# EAGLE design R201B (EAGLE 6.6.0)
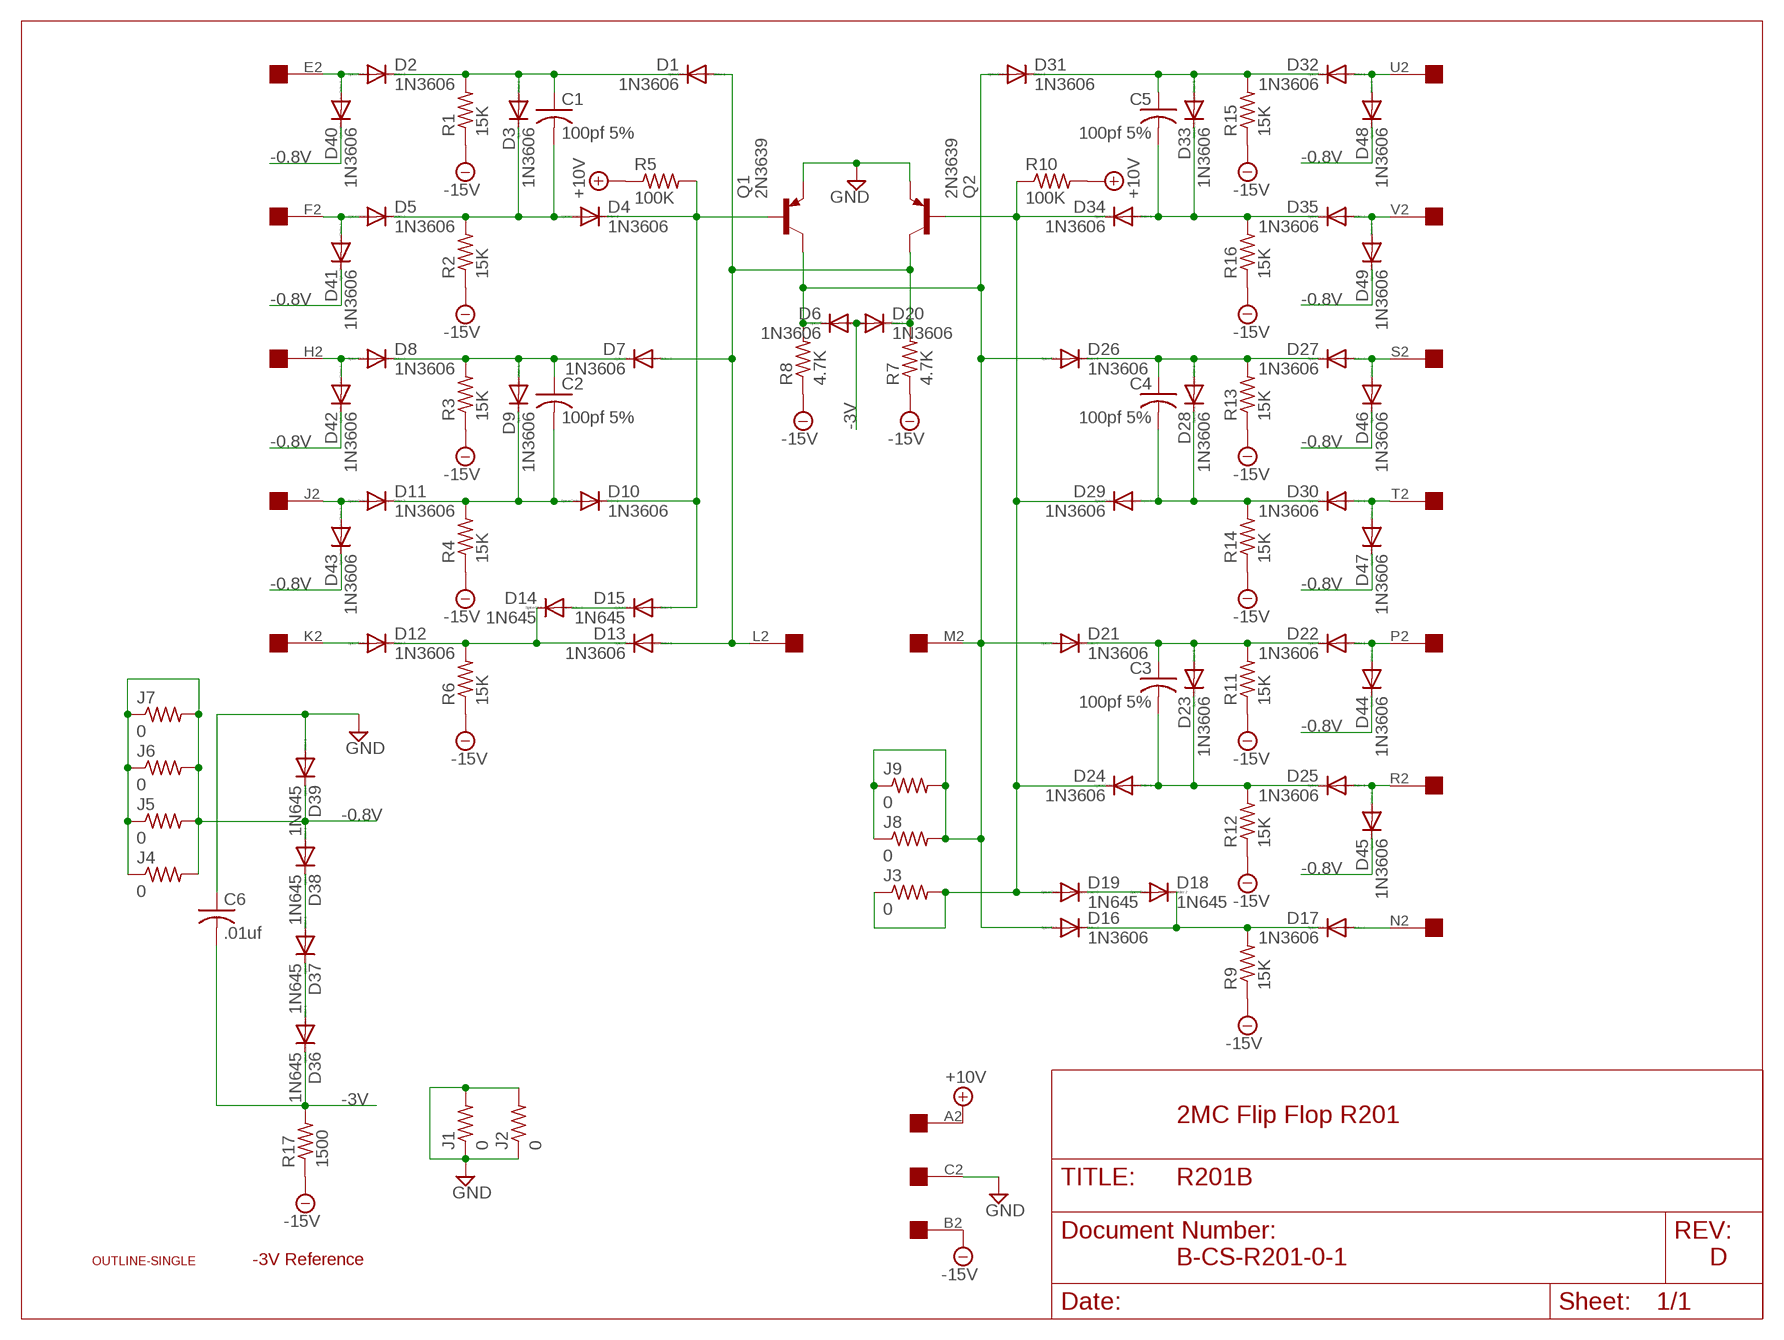
[diagram p0: schematic, sheet 1]

## Parts
C1  100pf 5%  C-US  [C063-025X075]
C2  100pf 5%  C-US  [C063-025X075]
C3  100pf 5%  C-US  [C063-025X075]
C4  100pf 5%  C-US  [C063-025X075]
C5  100pf 5%  C-US  [C063-025X075]
C6  .01uf  C-US  [C063-025X075]
D1  1N3606  1N4148DO35-10  [DO35-10]
D2  1N3606  1N4148DO35-10  [DO35-10]
D3  1N3606  1N4148DO35-10  [DO35-10]
D4  1N3606  1N4148DO35-10  [DO35-10]
D5  1N3606  1N4148DO35-10  [DO35-10]
D6  1N3606  1N4148DO35-10  [DO35-10]
D7  1N3606  1N4148DO35-10  [DO35-10]
D8  1N3606  1N4148DO35-10  [DO35-10]
D9  1N3606  1N4148DO35-10  [DO35-10]
D10  1N3606  1N4148DO35-10  [DO35-10]
D11  1N3606  1N4148DO35-10  [DO35-10]
D12  1N3606  1N4148DO35-10  [DO35-10]
D13  1N3606  1N4148DO35-10  [DO35-10]
D14  1N645  1N4148DO35-10  [DO35-10]
D15  1N645  1N4148DO35-10  [DO35-10]
D16  1N3606  1N4148DO35-10  [DO35-10]
D17  1N3606  1N4148DO35-10  [DO35-10]
D18  1N645  1N4148DO35-10  [DO35-10]
D19  1N645  1N4148DO35-10  [DO35-10]
D20  1N3606  1N4148DO35-10  [DO35-10]
D21  1N3606  1N4148DO35-10  [DO35-10]
D22  1N3606  1N4148DO35-10  [DO35-10]
D23  1N3606  1N4148DO35-10  [DO35-10]
D24  1N3606  1N4148DO35-10  [DO35-10]
D25  1N3606  1N4148DO35-10  [DO35-10]
D26  1N3606  1N4148DO35-10  [DO35-10]
D27  1N3606  1N4148DO35-10  [DO35-10]
D28  1N3606  1N4148DO35-10  [DO35-10]
D29  1N3606  1N4148DO35-10  [DO35-10]
D30  1N3606  1N4148DO35-10  [DO35-10]
D31  1N3606  1N4148DO35-10  [DO35-10]
D32  1N3606  1N4148DO35-10  [DO35-10]
D33  1N3606  1N4148DO35-10  [DO35-10]
D34  1N3606  1N4148DO35-10  [DO35-10]
D35  1N3606  1N4148DO35-10  [DO35-10]
D36  1N645  1N4148DO35-10  [DO35-10]
D37  1N645  1N4148DO35-10  [DO35-10]
D38  1N645  1N4148DO35-10  [DO35-10]
D39  1N645  1N4148DO35-10  [DO35-10]
D40  1N3606  1N4148DO35-10  [DO35-10]
D41  1N3606  1N4148DO35-10  [DO35-10]
D42  1N3606  1N4148DO35-10  [DO35-10]
D43  1N3606  1N4148DO35-10  [DO35-10]
D44  1N3606  1N4148DO35-10  [DO35-10]
D45  1N3606  1N4148DO35-10  [DO35-10]
D46  1N3606  1N4148DO35-10  [DO35-10]
D47  1N3606  1N4148DO35-10  [DO35-10]
D48  1N3606  1N4148DO35-10  [DO35-10]
D49  1N3606  1N4148DO35-10  [DO35-10]
J1  0  R-US_0207/10  [0207/10]
J2  0  R-US_0207/10  [0207/10]
J3  0  R-US_0207/10  [0207/10]
J4  0  R-US_0207/10  [0207/10]
J5  0  R-US_0207/10  [0207/10]
J6  0  R-US_0207/10  [0207/10]
J7  0  R-US_0207/10  [0207/10]
J8  0  R-US_0207/10  [0207/10]
J9  0  R-US_0207/10  [0207/10]
Q1  2N3639  2N3637  [TO39]
Q2  2N3639  2N3637  [TO39]
R1  15K  R-US_0207/10  [0207/10]
R2  15K  R-US_0207/10  [0207/10]
R3  15K  R-US_0207/10  [0207/10]
R4  15K  R-US_0207/10  [0207/10]
R5  100K  R-US_0207/10  [0207/10]
R6  15K  R-US_0207/10  [0207/10]
R7  4.7K  R-US_0207/10  [0207/10]
R8  4.7K  R-US_0207/10  [0207/10]
R9  15K  R-US_0207/10  [0207/10]
R10  100K  R-US_0207/10  [0207/10]
R11  15K  R-US_0207/10  [0207/10]
R12  15K  R-US_0207/10  [0207/10]
R13  15K  R-US_0207/10  [0207/10]
R14  15K  R-US_0207/10  [0207/10]
R15  15K  R-US_0207/10  [0207/10]
R16  15K  R-US_0207/10  [0207/10]
R17  1500  R-US_0207/10  [0207/10]
U$1  OUTLINE-SINGLE  [SINGLE]
U$2  EDGE-1  [EDGE-CON1]

## Nets
+10V [Power]: R5.1 R10.2 U$2.A2
-0.8V [Power]: D38.A D39.C D40.C D41.C D42.C D43.C D44.C D45.C D46.C D47.C D48.C D49.C J4.1 J4.2 J5.1 J5.2 J6.1 J6.2 J7.1 J7.2
-3V [Power]: C6.2 D6.A D20.A D36.C R17.2
-15V [Power]: R1.1 R2.1 R3.1 R4.1 R6.1 R7.1 R8.1 R9.1 R11.1 R12.1 R13.1 R14.1 R15.1 R16.1 R17.1 U$2.B2
GND [Power]: C6.1 D39.A J1.1 J1.2 J2.1 J2.2 Q1.1(E) Q2.1(E) U$2.C2
L: D1.A D7.A D13.A D20.C Q2.3(C) R7.2 U$2.L2
M: D6.C D16.A D21.A D26.A D31.A J8.1 J8.2 J9.1 J9.2 Q1.3(C) R8.2 U$2.M2
N$1: D5.A D41.A U$2.F2
N$2: C5.1 D31.C D32.C D33.A R15.2
N$3: C1.2 D3.C D4.A D5.C R2.2
N$4: C1.1 D1.C D2.C D3.A R1.2
N$5: D12.A U$2.K2
N$6: D19.A D24.C D29.C D34.C J3.1 J3.2 Q2.2(B) R10.1
N$7: D32.A D48.A U$2.U2
N$8: C5.2 D33.C D34.A D35.C R16.2
N$9: D17.A U$2.N2
N$10: D2.A D40.A U$2.E2
N$11: D35.A D49.A U$2.V2
N$12: D18.A D19.C
N$13: D37.A D38.C
N$14: D4.C D10.C D15.A Q1.2(B) R5.2
N$15: D14.A D15.C
N$16: D36.A D37.C
N$17: D22.A D44.A U$2.P2
N$18: D12.C D13.C D14.C R6.2
N$19: D8.A D42.A U$2.H2
N$20: D16.C D17.C D18.C R9.2
N$21: D11.A D43.A U$2.J2
N$22: C2.2 D9.C D10.A D11.C R4.2
N$23: D27.A D46.A U$2.S2
N$24: C2.1 D7.C D8.C D9.A R3.2
N$25: D30.A D47.A U$2.T2
N$26: C4.2 D28.C D29.A D30.C R14.2
N$27: C4.1 D26.C D27.C D28.A R13.2
N$28: D25.A D45.A U$2.R2
N$29: C3.2 D23.C D24.A D25.C R12.2
N$30: C3.1 D21.C D22.C D23.A R11.2
Unconnected: U$2.D2

## Notes on the sheet
- 2MC Flip Flop R201
- -3V Reference | B-CS-R201-0-1 | D

## Library data of the parts
C1-C6 = dec-con:C-US: Capacitors with funky DEC lead spacing.
D1-D49 = diode:1N4148: DIODE high speed (Philips)
J1-J9 R1-R17 = rcl:R-US_: RESISTOR, American symbol
Q1 Q2 = transistor-pnp:2N3637*: PNP Transistror
U$1 = dec-con:OUTLINE-*: Board outlines for DEC boards.
U$2 = dec-con:EDGE-1: Single-Sided DEC Edge Connector -- (side 2)

## Net classes
1 Power: width 0.813 mm

## Board
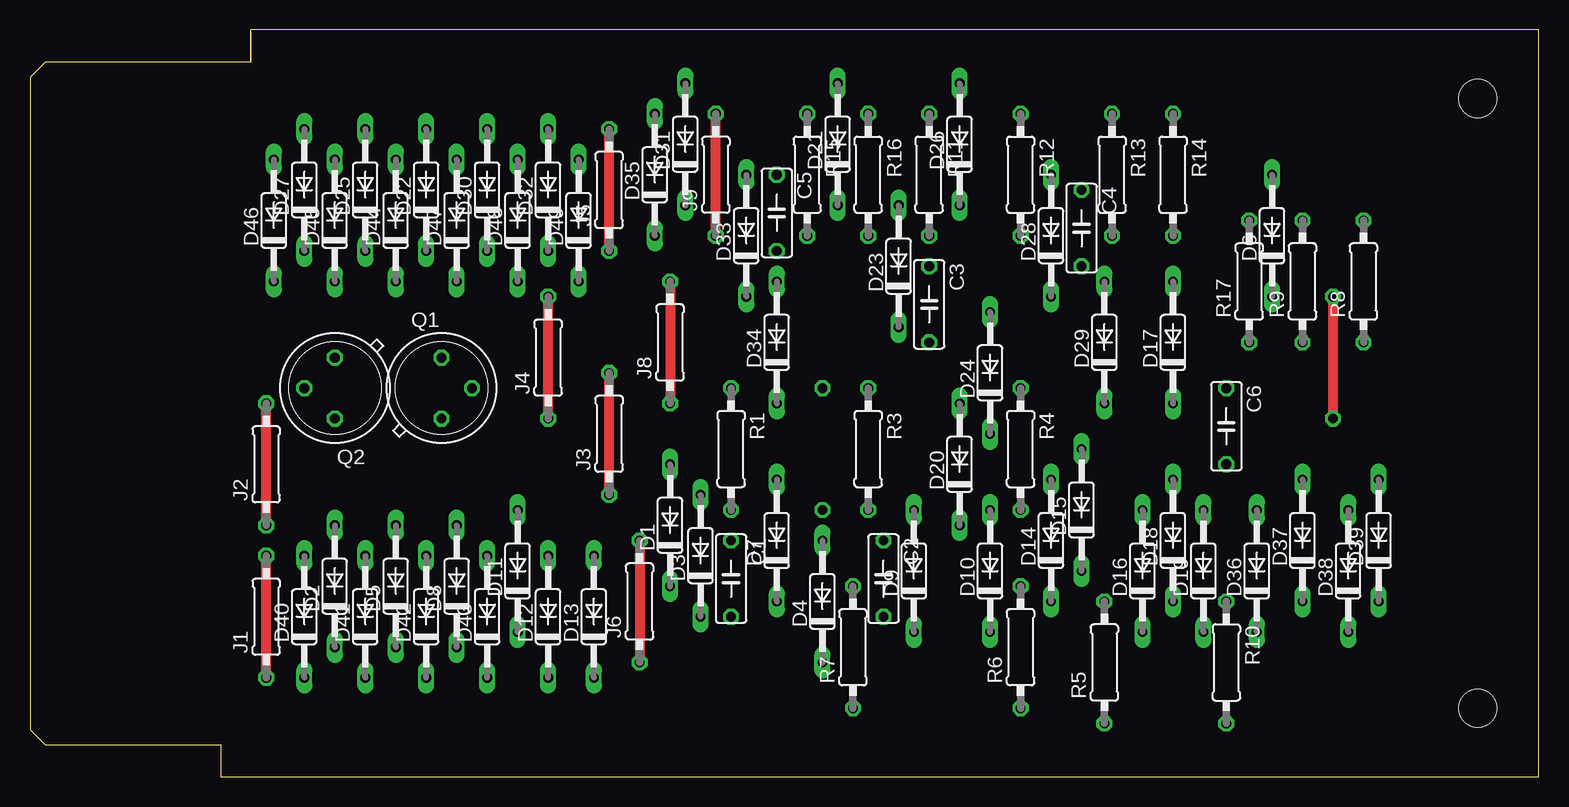
[diagram p1: board, top side]
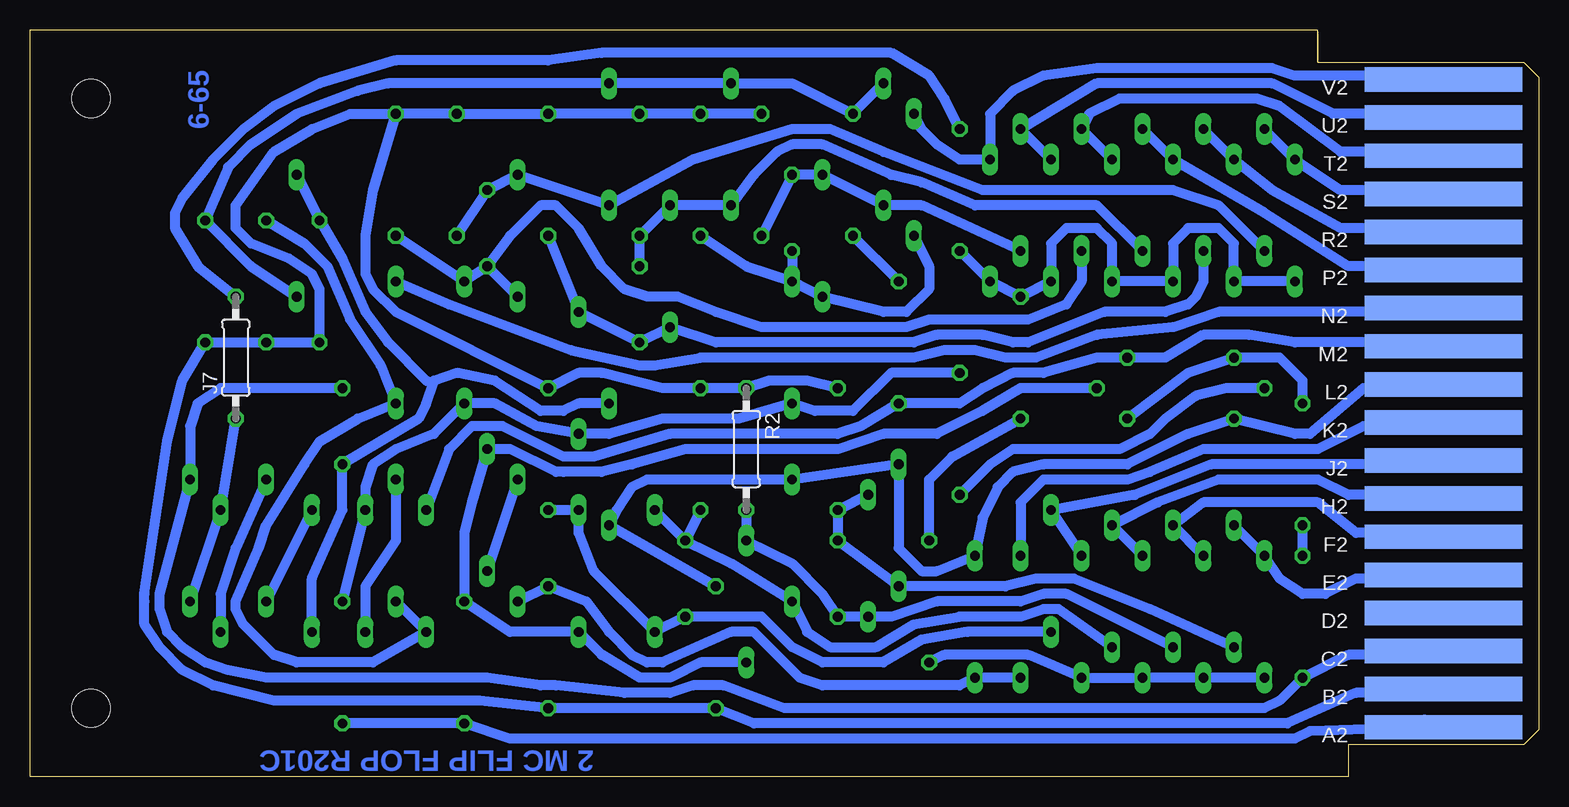
[diagram p2: board, bottom side, seen from below]

Size 125.73 x 62.23 mm. Coordinates in mm from the lower left corner, seen from the top.
Copper layers (1+16): Top 0.035mm / dielectric 1.5mm / Bottom 0.035mm
Design rules "16mils": minimum track width 16mil, minimum drill 32mil, track to track 15mil, track to pad 10mil, pad to pad 10mil, via to via 10mil, smd to smd 10mil, copper to edge 13mil, drill to drill 10mil, minimum pad ring 10mil, minimum via ring 8mil, stop-mask expansion 0mil, vias tented up to drill 0mil, thermal gap 10mil

### Footprints (pad centres in the part's own frame; a part is rotated, then mirrored left to right if it is on the bottom)
C063-025X075 = drill 0.813 octagon: 1 -2.54,0; 2 3.81,0
DO35-10 = drill 0.813 long: A 5.08,0; C -5.08,0
0207/10 = drill 0.813 octagon: 1 -5.08,0; 2 5.08,0
TO39 = drill 0.813 octagon: 1 0,-2.54; 2 2.54,0; 3 0,2.54
SINGLE = hole 3.175: 120.65,56.515; 120.65,5.715
EDGE-CON1 = smd 13.106 x 2.032 bottom: A2 7.938,4.128; B2 7.938,7.303; C2 7.938,10.477; D2 7.938,13.652; E2 7.938,16.828; F2 7.938,20.003; H2 7.938,23.177; J2 7.938,26.352; K2 7.938,29.527; L2 7.938,32.703; M2 7.938,35.877; N2 7.938,39.053; P2 7.938,42.227; R2 7.938,45.403; S2 7.938,48.578; T2 7.938,51.752; U2 7.938,54.928; V2 7.938,58.102

### Placement (x,y rotation side)
C1  58.42,17.14 270 top
C2  71.12,17.14 270 top
C3  74.93,40.01 270 top
C4  87.63,46.35 270 top
C5  62.23,47.62 270 top
C6  99.7,29.84 270 top
D1  53.34,20.95 90 top
D2  25.4,15.88 90 top
D3  55.88,18.41 90 top
D4  66.04,14.61 90 top
D5  30.48,15.88 90 top
D6  103.51,45.09 90 top
D7  62.23,19.68 90 top
D8  35.56,15.88 90 top
D9  73.66,17.14 90 top
D10  80.01,17.14 90 top
D11  40.64,17.14 90 top
D12  43.18,13.34 90 top
D13  46.99,13.34 90 top
D14  85.09,19.68 90 top
D15  87.63,22.23 90 top
D16  92.71,17.14 90 top
D17  95.25,36.2 90 top
D18  95.25,19.68 90 top
D19  97.79,17.14 90 top
D20  77.47,26.04 90 top
D21  67.31,52.7 90 top
D22  33.02,48.9 90 top
D23  72.39,42.55 90 top
D24  80.01,33.66 90 top
D25  27.94,48.9 90 top
D26  77.47,52.7 90 top
D27  22.86,48.9 90 top
D28  85.09,45.09 90 top
D29  89.54,36.2 90 top
D30  38.1,48.9 90 top
D31  54.61,52.7 90 top
D32  43.18,48.9 90 top
D33  59.69,45.09 90 top
D34  62.23,36.2 90 top
D35  52.07,50.16 90 top
D36  102.24,17.14 90 top
D37  106.05,19.68 90 top
D38  109.86,17.14 90 top
D39  112.4,19.68 90 top
D40  22.86,13.34 90 top
D41  27.94,13.34 90 top
D42  33.02,13.34 90 top
D43  38.1,13.34 90 top
D44  30.48,46.35 90 top
D45  25.4,46.35 90 top
D46  20.32,46.35 90 top
D47  35.56,46.35 90 top
D48  40.64,46.35 90 top
D49  45.72,46.35 90 top
J1  19.69,13.34 90 top
J2  19.69,26.04 90 top
J3  48.26,28.57 90 top
J4  43.18,34.92 90 top
J5  48.26,48.9 90 top
J6  50.8,14.61 90 top
J7  108.59,34.92 90 bottom
J8  53.34,36.2 90 top
J9  57.15,50.16 90 top
Q1  34.29,32.38 0 top
Q2  25.4,32.38 180 top
R1  58.42,27.3 270 top
R2  66.04,27.3 270 bottom
R3  69.85,27.3 270 top
R4  82.55,27.3 270 top
R5  89.54,9.53 90 top
R6  82.55,10.79 90 top
R7  68.58,10.79 90 top
R8  111.13,41.27 90 top
R9  106.05,41.27 90 top
R10  99.7,9.53 270 top
R11  74.93,50.16 270 top
R12  82.55,50.16 270 top
R13  90.17,50.16 270 top
R14  95.25,50.16 270 top
R15  64.77,50.16 270 top
R16  69.85,50.16 270 top
R17  101.6,41.27 90 top
U$1  0,0 0 top
U$2  0,0 0 top

### Tracks (layer width: path | path; a pad name or v marks a point on that pad's centre or on a via)
+10V
  Bottom 0.813: U$2.A2 9.53,4.76 9.53,4.13 19.05,3.81 20.32,3.17 85.73,3.17 R5.1 R10.2
-0.8V
  Top 0.813: J4.1 J4.2 | J5.1 J5.2 | J6.2 J6.1 | J7.1 J7.2
  Bottom 0.813: D46.C D45.C 25.4,44.45 26.67,45.72 29.21,45.72 30.48,44.45 D44.C D47.C 35.56,44.45 36.83,45.72 39.37,45.72 40.64,44.45 D48.C J4.2 D49.C J5.1 | D40.C D41.C D42.C D43.C 42.55,10.16 49.53,10.16 J6.1 | J5.2 49.53,56.52 50.8,58.42 53.98,60.33 78.11,60.33 82.55,59.69 95.25,59.69 101.6,57.78 105.41,55.88 107.95,53.98 110.49,51.44 113.03,48.26 113.67,46.99 113.67,45.72 111.76,42.55 J7.2 | J6.2 50.8,24.77 48.9,26.67 J4.1 | J7.1 D38.A D39.C
-3V
  Bottom 0.813: D20.A 80.01,31.11 81.28,30.48 83.19,30.48 87,33.02 90.17,33.66 92.08,33.02 92.14,32.83 | 92.14,32.83 92.71,31.11 93.35,29.84 C6.2 99.7,22.23 102.24,16.51 D36.C | D6.A R17.2 99.7,43.18 97.79,38.73 95.89,36.2 92.71,33.02 92.14,32.83
-15V
  Bottom 0.813: U$2.B2 8.26,6.99 15.24,6.99 20.96,4.45 65.41,4.45 R7.1 R6.1 88.27,6.35 105.41,6.35 110.49,7.62 113.03,8.89 114.94,10.79 116.21,12.7 116.21,14.61 116.21,15.24 114.3,27.94 113.03,33.02 R8.1 R9.1 R17.1 101.6,40.64 102.24,41.91 104.14,43.18 107.32,44.45 108.59,45.72 108.59,47.62 105.41,52.07 102.24,53.98 99.06,55.24 R14.1 | R15.1 R16.1 R11.1 R12.1 R13.1 R14.1 | R14.1 97.16,48.9 97.79,45.09 97.79,41.91 97.16,40.64 95.25,38.73 R4.1 80.01,33.66 78.11,33.66 73.03,32.38 R3.1 R2.1 64.14,33.02 60.96,33.02 R1.1
GND
  Top 0.813: J1.1 J1.2 | J2.1 J2.2
  Bottom 0.813: J1.2 J2.1 | U$2.C2 8.89,10.16 15.88,10.16 J1.1 21.59,6.35 22.86,5.71 62.87,5.71 67.95,7.62 70.49,7.62 72.39,6.99 76.2,6.99 81.92,7.62 83.19,7.62 87.63,8.26 106.05,8.26 109.22,8.89 111.13,9.53 113.03,10.79 114.3,12.06 114.94,13.97 114.94,15.24 D39.A 112.4,29.21 111.76,31.11 109.86,32.38 C6.1 | J2.2 19.69,33.02 21.59,34.92 Q2.1 29.21,33.66 Q1.1
L
  Bottom 0.813: U$2.L2 9.53,32.38 14.61,32.38 19.05,28.57 20.32,28.57 Q2.3 29.21,28.57 34.29,26.04 41.28,26.04 43.82,25.4 45.09,24.13 46.36,21.59 D13.A 50.17,17.14 51.44,17.14 53.34,19.05 D1.A D7.A 74.3,24.77 75.57,24.13 76.84,22.23 D20.C R7.2
M
  Top 0.813: J9.1 J9.2 | J8.2 J8.1
  Bottom 0.813: J8.2 J9.1 | U$2.M2 8.89,36.2 20.32,36.2 24.13,36.83 27.94,36.83 31.12,34.92 Q1.3 36.83,34.92 41.28,33.66 43.82,33.66 46.36,32.38 48.26,31.11 J8.1 56.52,29.21 58.42,28.57 72.39,28.57 78.74,26.67 81.28,26.67 86.36,29.21 88.9,29.21 90.81,27.3 D16.A | D31.A J9.2 62.23,57.78 D21.A D26.A 95.89,57.78 98.43,57.15 103.51,55.24 107.32,52.7 109.22,50.8 R8.2 107.32,42.55 D6.C
N$1
  Bottom 0.813: D41.A D5.A 27.94,22.86 18.42,22.86 15.24,20.32 8.89,20.32 U$2.F2
N$2
  Bottom 0.813: D32.C 51.44,47.62 D31.C D33.A C5.1 R15.2
N$3
  Bottom 0.813: D5.C 39.37,15.24 41.28,15.24 43.18,14.61 50.17,14.61 53.98,13.34 D3.C C1.2 59.69,15.24 62.23,17.78 D4.A R2.2
N$4
  Bottom 0.813: D2.C 32.39,13.97 38.74,16.51 39.37,16.51 41.91,16.51 44.45,15.88 D1.C C1.1 R1.2 D3.A
N$5
  Bottom 0.813: U$2.K2 8.89,29.21 14.61,29.21 18.42,27.3 27.94,27.3 32.39,25.4 34.29,24.77 41.28,24.77 43.18,22.86 D12.A
N$6
  Top 0.813: J3.1 J3.2
  Bottom 0.813: Q2.2 26.04,32.38 28.58,31.75 31.12,29.84 32.39,28.57 34.93,27.3 43.82,27.3 45.72,26.04 J3.1 | J3.2 53.98,33.66 57.15,30.48 60.33,30.48 D34.C 66.68,29.84 73.03,29.84 77.47,28.57 D24.C 83.5,29.21 87,31.11 D29.C 92.08,28.57 95.25,27.3 97.16,26.04 97.79,24.13 D19.A R10.1
N$7
  Bottom 0.813: D48.A D32.A 36.83,57.78 22.23,57.78 17.15,55.24 8.89,55.24 U$2.U2
N$8
  Bottom 0.813: C5.2 D34.A | R16.2 66.04,42.55 D34.A | D34.A D33.C 54.61,38.73 52.71,38.73 50.8,40.64 50.8,42.55 D35.C
N$9
  Bottom 0.813: U$2.N2 9.53,38.73 26.67,38.73 30.48,37.47 36.83,36.83 41.91,34.92 44.45,34.92 46.99,35.56 49.53,35.56 52.07,34.92 69.85,34.92 73.66,34.29 74.93,34.29 80.65,35.56 90.81,39.37 D17.A
N$10
  Bottom 0.813: D2.A D40.A 21.59,16.51 19.69,15.24 17.78,15.24 15.24,16.51 8.89,16.51 U$2.E2
N$11
  Bottom 0.813: U$2.V2 8.89,58.42 20.32,58.42 22.23,59.05 36.83,59.05 41.28,58.42 43.82,57.15 45.72,55.24 D49.A 48.26,51.44 50.17,52.7 51.44,53.98 D35.A
N$12
  Bottom 0.813: D18.A 95.25,19.68 97.79,15.88 D19.C
N$13
  Bottom 0.813: D37.A 108.59,19.05 109.86,15.24 D38.C
N$14
  Bottom 0.813: Q1.2 43.18,32.38 46.36,30.48 50.17,28.57 54.61,28.57 58.42,27.3 71.12,27.3 75.57,26.04 78.11,25.4 81.28,25.4 81.92,25.4 85.73,27.3 D15.A 88.9,22.86 89.54,20.32 R5.2 85.73,12.06 D10.C 78.11,10.16 74.93,8.26 72.39,8.26 69.85,9.53 D4.C
N$15
  Bottom 0.813: D14.A D15.C
N$16
  Bottom 0.813: D36.A D37.C
N$17
  Bottom 0.813: D22.A D44.A 22.86,46.99 15.88,42.55 8.89,42.55 U$2.P2
N$18
  Bottom 0.813: D12.C D13.C 48.26,7.62 59.69,7.62 61.6,8.26 65.41,12.06 67.31,12.06 73.03,9.53 74.3,9.53 75.57,10.16 77.47,12.06 79.38,14.61 R6.2 D14.C
N$19
  Bottom 0.813: D42.A D8.A 31.75,22.86 26.67,24.77 18.42,24.77 15.88,23.5 8.89,23.5 U$2.H2
N$20
  Bottom 0.813: R9.2 102.87,44.45 100.97,42.55 99.06,38.1 96.52,34.29 D17.C 98.43,29.84 101.6,27.94 102.87,26.04 106.05,20.95 106.68,19.05 108.59,14.61 108.59,13.97 107.95,12.7 105.41,10.16 103.51,9.53 97.16,9.53 D16.C D18.C
N$21
  Bottom 0.813: D43.A D11.A 33.66,23.5 27.31,26.04 8.26,26.04 U$2.J2
N$22
  Bottom 0.813: D11.C 47.63,12.06 51.44,11.43 54.61,9.53 59.69,9.53 62.23,10.79 64.77,13.34 C2.2 D9.C 78.74,17.14 80.01,20.32 D10.A R4.2
N$23
  Bottom 0.813: D27.A D46.A 16.51,48.9 9.53,48.9 U$2.S2
N$24
  Bottom 0.813: D8.C 40.01,13.97 41.28,13.97 43.18,13.34 48.26,13.34 52.07,12.7 55.25,10.79 59.06,10.79 60.96,12.06 D7.C 67.31,17.78 C2.1 | R3.2 C2.1 | D9.A C2.1
N$25
  Bottom 0.813: D47.A D30.A 37.47,55.24 34.93,56.52 23.5,56.52 21.59,55.88 16.51,52.07 9.53,52.07 U$2.T2
N$26
  Bottom 0.813: D30.C 38.1,41.27 39.37,39.37 42.55,38.1 50.8,38.1 52.71,37.47 64.77,37.47 68.58,38.73 71.76,40.01 74.3,40.01 76.2,40.64 78.11,42.55 80.01,45.72 81.92,47.62 83.19,47.62 85.73,45.09 C4.2 | D28.C C4.2 | C4.2 D29.A R14.2
N$27
  Bottom 0.813: D27.C 26.67,47.62 30.48,48.9 46.36,48.9 54.61,52.07 59.06,53.98 59.69,53.98 62.23,53.98 70.49,51.44 D26.C D28.A C4.1 R13.2
N$28
  Bottom 0.813: D25.A D45.A 22.23,48.9 16.51,45.72 8.89,45.72 U$2.R2
N$29
  Bottom 0.813: D25.C 27.94,41.27 28.58,40.01 29.21,39.37 31.12,38.73 36.2,38.73 42.55,36.2 43.82,36.2 46.36,36.83 50.17,36.83 52.07,36.2 68.58,36.2 D23.C C3.2 D24.A R12.2
N$30
  Bottom 0.813: D22.C 36.83,47.62 46.99,47.62 51.44,49.53 53.98,50.16 59.69,52.7 62.23,52.7 63.5,52.07 65.41,50.16 D21.C D23.A R11.2 C3.1

### Text on the board
Bottom: 6-65 | 2 MC FLIP FLOP R201C